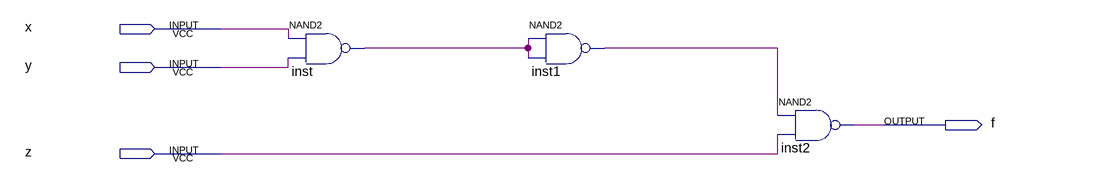
[diagram p0: schematic sheet]
// Quartus schematic 1.1.bdf as structural Verilog: 3 symbols, 4 pins
module \1.1  (
  input  x,
  input  y,
  input  z,
  output f
);

  wire inst1_out, inst_out;

  nand inst (inst_out, x, y);
  nand inst1 (inst1_out, inst_out, inst_out);
  nand inst2 (f, inst1_out, z);
endmodule
